# Altium project PCB_Project.PrjPcb
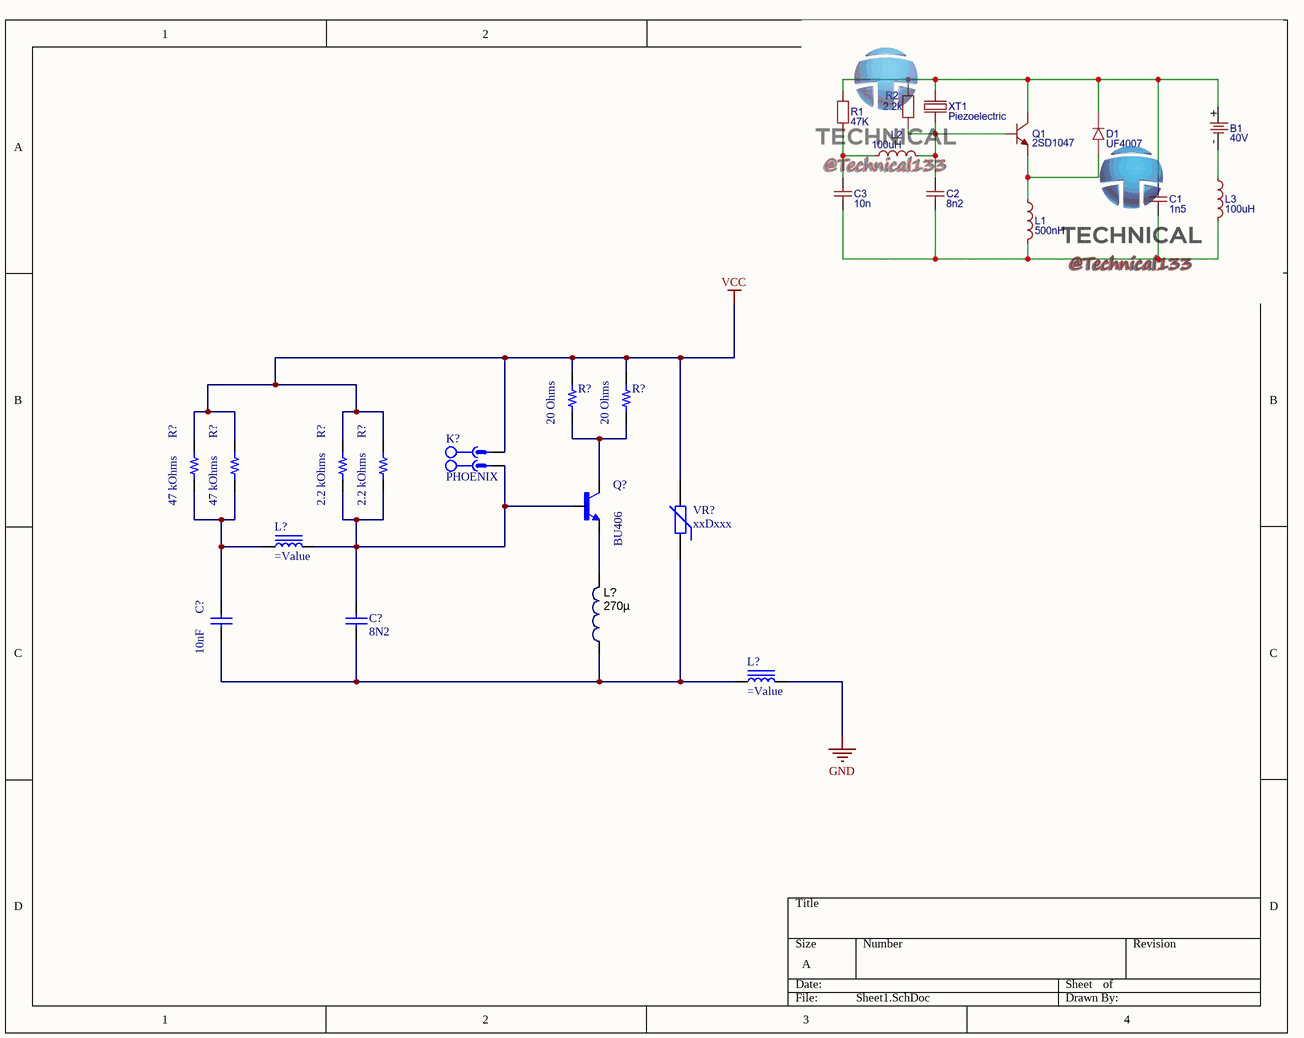
[diagram p0: Sheet1.SchDoc]
3 sheets, 62 parts. Net scope: global (net labels, ports and power ports of the same name join across sheets).
Board file: PCB1.PcbDoc
Sheets:
  Sheet1.SchDoc
  2_POWER.SchDoc
  3_FLOATER.SchDoc

## Sheet Sheet1.SchDoc
size A; SheetNumber: 1; SheetTotal: 2

### Parts
(Parts that share a designator on the sheet are numbered #1, #2 ... from top to bottom, then left to right.)
C?#1  10nF  [Cap-100nF-400V]
C?#2  8N2  [Cap-220n-400V_Poly]
K?  PHOENIX  [KEY]
L?#1  (no value)  [BOURNS SRR1280]
L?#2  270µ  [Inductor 10x12 (200 mils)]
L?#3  (no value)  [BOURNS SRR1280]
Q?#1  BU406
R?#1  20 Ohms  [RES 2512_6432]
R?#2  20 Ohms  [RES 2512_6432]
R?#3  47 kOhms  [RES 1206_3216]
R?#4  47 kOhms  [RES 1206_3216]
R?#5  2.2 kOhms  [RES 1206_3216]
R?#6  2.2 kOhms  [RES 1206_3216]
VR?  xxDxxx  [07D XXX]

### Nets
GND: L?#3.2  [project net floter+l]
VCC: K?.2 R?#1.2 R?#2.2 R?#3.2 R?#4.2 R?#5.2 R?#6.2 VR?.2
NetC?#1_1: C?#1.1 C?#2.1 L?#2.1 L?#3.1 VR?.1
NetC?#1_2: C?#1.2 L?#1.1 R?#3.1 R?#4.1
NetC?#2_2: C?#2.2 K?.1 L?#1.2 Q?#1.1(B) R?#5.1 R?#6.1
NetL?#2_2: L?#2.2 Q?#1.3(E)
NetQ?#1_2: Q?#1.2(C) R?#1.1 R?#2.1

### Library data of the parts
C?#1 C?#2 = CAP CERAMIC TOTAL SIZE: CAP Ceramic Total; Designer: Ali Hafizi
K? = KEY: 2 Pitch: 5.08 mm Color: green Contact surface: Tin Assembly; Manufacturer: PHOENIX CONTACT; Connector type: PCB Terminal Block; designer: ABBAS BASEREH; Max Current: 12 A; Positions: 2; Voltage: 320 V; Category: Connector; ComponentLink1Description: Header, Nominal current: 12 A Rated voltage (III/2): 320 V Number of positions: 2 Pitch: 5.08 mm Color: green Contact surface: Tin Assembly: Soldering  DESIGNER:ABBAS BASEREH; ComponentLink2Description: Reference; Mounting Technology: Through-Hole; Pin Count: 2; Revision 1: 2017-3-1; Status: Unreleased; PART.NO: PHOENIX
L?#1 L?#3 = SRR1280-680M: FIXED IND 68UH 2.4A 120 MOHM SMD; Part Number: SRR1280-680M
L?#2 = POWER INDUCTOR 10x12 (200 mils): Tolerance: ±20%; Type: Ferrite Core; SCDType: source; Package / Case: POWER INDUCTOR 10x12 (200 mils); Supplier 1: Digi-Key; Operating Temperature: -40°C ~ 125°C; Value: 270µ; PUBLISHER: ABBAS BASEREH  2017-3-1
Q?#1 = NPN BJT: Bipolar (BJT) Transistor NPN 40 V 3 A 3MHz 2 W Through Hole TO-220; MF: ON Semiconductor; MP: TIP31G; SnapEDA_Link: https://www.snapeda.com/parts/TIP31G/Onsemi/view-part/?ref=snap; Availability: In Stock; Purchase-URL: https://pricing.snapeda.com/search/part/TIP31G/?ref=eda; Check_prices: https://www.snapeda.com/parts/TIP31G/Onsemi/view-part/?ref=eda; Value: *; Package: TO-220-3 ON Semiconductor; Price: None
R?#1 R?#2 = CRM2512-JW-200ELF: RES SMD 20 OHM 5% 2W 2512; Manufacturer: Bourns Inc.; Temperature Coefficient: ±200ppm/°C; Part Number: CRM2512-JW-200ELF; ComponentLink1Description: Datasheet; ComponentLink1URL: https://www.bourns.com/docs/Product-Datasheets/CRM.pdf; ComponentLink2Description: DigiKey Link; ComponentLink2URL: http://digikey.com/product-detail/en/bourns-inc/CRM2512-JW-200ELF/118-CRM2512-JW-200ELFCT-ND/10673821; Composition: Thick Film; Device Package: 2512 (6432 Metric); Features: Current Sense; Height - Seated (Max): 0.031" (0.80mm); LastUpdated: 9/2/2020 1:26:49 AM; Lifecycle Status: Active; Minimum Order: 1; Number of Terminations: 2; Operating Temperature: -55°C ~ 155°C; Package / Case: 2512 (6432 Metric); Packaging: TapeAndReel; Part Status: Active; Power (Watts): 2W; Price: 0.06; Resistance: 20 Ohms; Series: CRM2512; Size / Dimension: 0.248" L x 0.122" W (6.30mm x 3.10mm); Supplier 1: DigiKey; Supplier Part Number 1: 118-CRM2512-JW-200ELFCT-ND; Supplier Device Package: 2512; Tolerance: ±5%; Value: 20 Ohms
R?#3 R?#4 = ERA-8ARW473V: RES SMD 47K OHM 0.05% 1/4W 1206; Manufacturer: Panasonic Electronic Components; Power (Watts): 0.25W, 1/4W; Temperature Coefficient: ±10ppm/°C; Part Number: ERA-8ARW473V; ComponentLink1Description: Datasheet; ComponentLink1URL: https://industrial.panasonic.com/cdbs/www-data/pdf/RDM0000/AOA0000C307.pdf; ComponentLink2Description: DigiKey Link; ComponentLink2URL: http://digikey.com/product-detail/en/panasonic-electronic-components/ERA-8ARW473V/P47KCTCT-ND/5141480; Composition: Thin Film; Device Package: 1206 (3216 Metric); Features: Automotive AEC-Q200; Height - Seated (Max): 0.028" (0.70mm); LastUpdated: 1/30/2023 8:32:42 PM; Lifecycle Status: Active; Minimum Order: 1; Number of Terminations: 2; Operating Temperature: -55°C ~ 155°C; Package / Case: 1206 (3216 Metric); Packaging: TapeAndReel; PartId: 27491; Part Status: Active; Price: 0.57; Ratings: AEC-Q200; Resistance: 47 kOhms; Series: ERA-8A; Size / Dimension: 0.126" L x 0.063" W (3.20mm x 1.60mm); Supplier 1: DigiKey; Supplier Part Number 1: P47KCTCT-ND; Supplier Device Package: 1206; Tolerance: ±0.05%; Value: 47 kOhms
R?#5 R?#6 = RCS12062K20FKEA: RCS1206 100 2K2 1% ET1 E3; Manufacturer: Vishay Dale; Power (Watts): 0.5W, 1/2W; Temperature Coefficient: ±100ppm/°C; Part Number: RCS12062K20FKEA; ComponentLink1Description: Datasheet; ComponentLink1URL: http://www.vishay.com/docs/20065/rcse3.pdf; ComponentLink2Description: DigiKey Link; ComponentLink2URL: https://www.digikey.com/en/products/detail/vishay-dale/RCS12062K20FKEA/10059678; Composition: Thick Film; Device Package: 1206 (3216 Metric); Features: Automotive AEC-Q200, Pulse Withstanding; Height - Seated (Max): 0.026" (0.65mm); LastUpdated: 1/30/2023 8:31:41 PM; Lifecycle Status: Active; Minimum Order: 1; Number of Terminations: 2; Operating Temperature: -55°C ~ 155°C; Package / Case: 1206 (3216 Metric); Packaging: TapeAndReel; PartId: 40840; Part Status: Active; Price: 0.04; Ratings: AEC-Q200; Resistance: 2.2 kOhms; Series: RCS e3; Size / Dimension: 0.126" L x 0.063" W (3.20mm x 1.60mm); Supplier 1: DigiKey; Supplier Part Number 1: 541-10612-1-ND; Supplier Device Package: 1206; Tolerance: ±1%; Value: 2.2 kOhms
VR? = VARISTOR (VDR): VARISTORS; Manufacturer: china-canada-philipina; Designer: Abbas Basereh; Models: MOV-VDR-COV; Data: 2017-1-5; Link: digikey.com; VALUE: xxDxxx; PUBLISHER: ABBAS BASEREH

## Sheet 2_POWER.SchDoc
size A; SheetNumber: 2; SheetTotal: 3
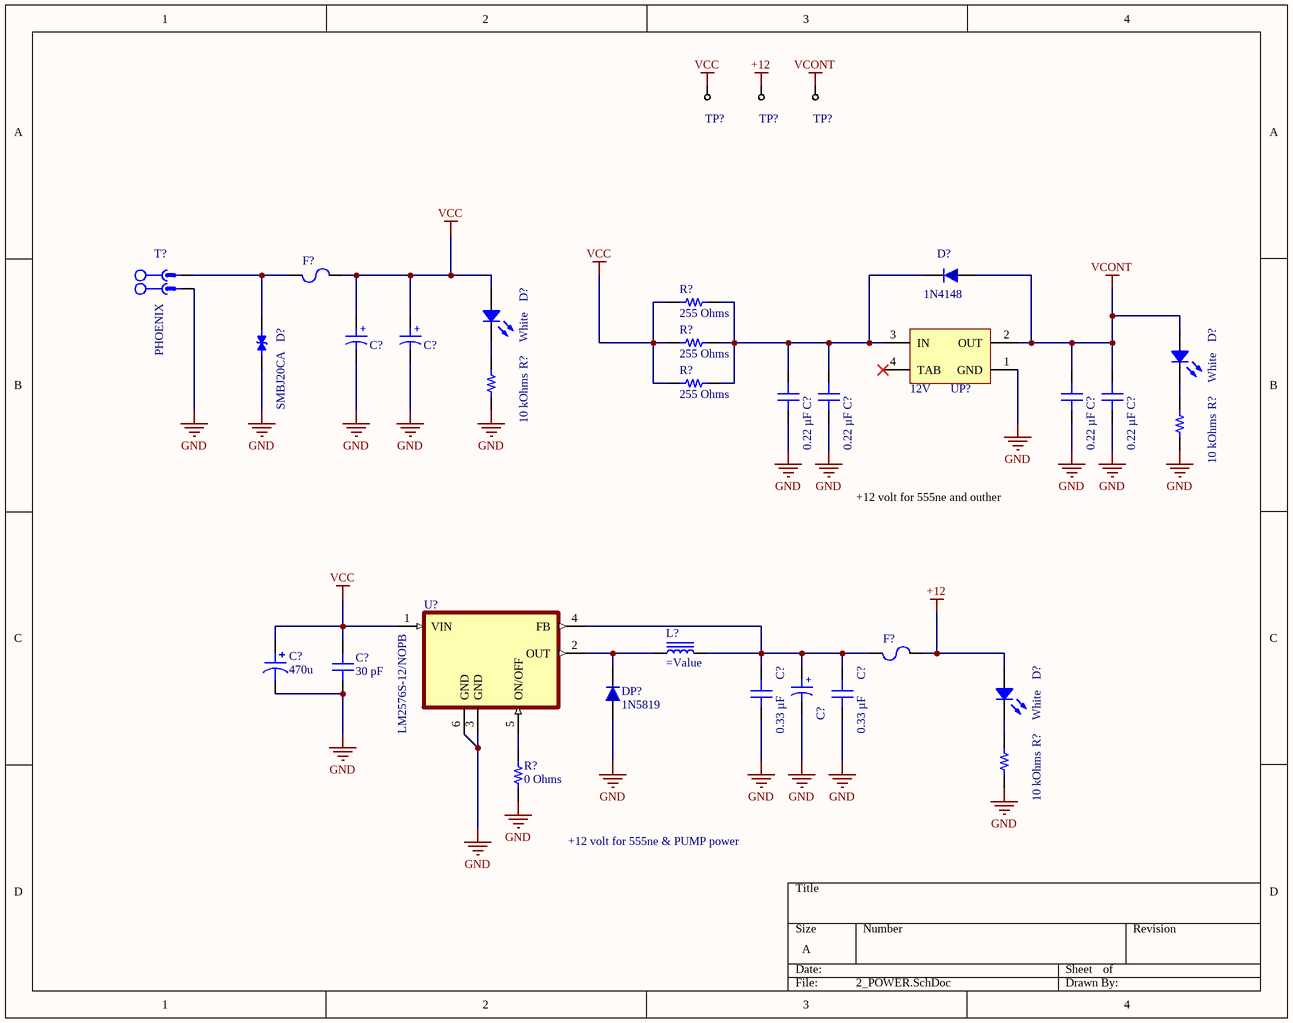
[diagram p1: 2_POWER.SchDoc]

### Parts
(Parts that share a designator on the sheet are numbered #1, #2 ... from top to bottom, then left to right.)
C?#3  Cap 10x21  [Cap electrolitic radial 10x20-5]  (value not drawn)
C?#4  Cap 10x21  [Cap electrolitic radial 10x20-5]  (value not drawn)
C?#5  0.22 µF  [CAP 1206_3216 - 0.8MM]
C?#6  0.22 µF  [CAP 1206_3216 - 0.8MM]
C?#7  0.22 µF  [CAP 1206_3216 - 0.8MM]
C?#8  0.22 µF  [CAP 1206_3216 - 0.8MM]
C?#9  470u  [CAP TH ALUM ELEC D10.00mm S5.00mm H17.50mm]
C?#10  30 pF  [CAP 0603_1608]
C?#11  Cap 10x21  [Cap electrolitic radial 10x20-5]  (value not drawn)
C?#12  0.33 µF  [CAP 0603_1608]
C?#13  0.33 µF  [CAP 0603_1608]
D?#1  1N4148  [Diode 1n4148 SMD]
D?#2  White  [LED 0603_1608]
D?#3  SMBJ20CA  [SMBJ20CA]
D?#4  White  [LED 0603_1608]
D?#5  White  [LED 0603_1608]
DP?#1  1N5819  [1N5819]
F?#1  3413.0214.22  [FUSE 1206_3216 0.6MM]  (value not drawn)
F?#2  3413.0214.22  [FUSE 1206_3216 0.6MM]  (value not drawn)
L?#4  (no value)  [BOURNS SRR1280]
R?#7  255 Ohms  [RES 1206_3216]
R?#8  255 Ohms  [RES 1206_3216]
R?#9  10 kOhms  [RES 0603_1608]
R?#10  255 Ohms  [RES 1206_3216]
R?#11  10 kOhms  [RES 0603_1608]
R?#12  10 kOhms  [RES 0603_1608]
R?#13  0 Ohms  [RES 0603_1608]
T?  PHOENIX  [ptr]
TP?#1  Test Point  [Test Point]  (value not drawn)
TP?#2  Test Point  [Test Point]  (value not drawn)
TP?#3  Test Point  [Test Point]  (value not drawn)
U?  LM2576S-12/NOPB  [LM2576S-12/NOPB]
UP?  12V  [SOT223]

### Nets
+12: D?#5.1 F?#2.2 TP?#2.1(T)
GND: C?#3.2 C?#4.2 C?#5.1 C?#6.1 C?#7.1 C?#8.1 C?#9.2 C?#10.1 C?#11.2 C?#12.1 C?#13.1 D?#3.1 DP?#1.1 R?#9.1 R?#11.1 R?#12.1 R?#13.1 T?.1 U?.3(GND) U?.6(GND) UP?.1(GND)  [project net floter+l]
VCC: C?#3.1 C?#4.1 C?#9.1 C?#10.2 D?#2.1 F?#1.2 R?#7.1 R?#8.1 R?#10.1 TP?#1.1(T) U?.1(VIN)
VCONT: C?#7.2 C?#8.2 D?#1.1 D?#4.1 TP?#3.1(T) UP?.2(OUT)
NetC?#5_2: C?#5.2 C?#6.2 D?#1.2 R?#7.2 R?#8.2 R?#10.2 UP?.3(IN)
NetC?#11_1: C?#11.1 C?#12.2 C?#13.2 F?#2.1 L?#4.2 U?.4(FB)
NetD?#2_2: D?#2.2 R?#9.2
NetD?#3_2: D?#3.2 F?#1.1 T?.2
NetD?#4_2: D?#4.2 R?#11.2
NetD?#5_2: D?#5.2 R?#12.2
NetDP?#1_2: DP?#1.2 L?#4.1 U?.2(OUT)
NetR?#13_2: R?#13.2 U?.5(ON/OFF)

Not connected (* = marked no-connect by the designer): UP? 4(TAB)*

### Notes on the sheet
- +12 volt for 555ne and outher controler
- +12 volt for 555ne & PUMP power
- (in symbol Cap electrolitic radial 10x21) +

### Library data of the parts
C?#3 C?#4 C?#11 = Cap electrolitic radial 10x21: Cap electrolitic radial; Part. No: 100U/50V; Designer: Abbas Basereh; Data: 16-12-2016
C?#5-C?#8 = 885012208089: CAP CER 0.22UF 50V X7R 1206; manufacturer: Würth Elektronik; Tolerance: ±10%; Part Number: 885012208089; Value: 0.22 µF; Applications: General Purpose; Capacitance: 0.22 µF; componentlink1description: Datasheet; componentlink1url: https://katalog.we-online.de/pbs/datasheet/885012208089.pdf; componentlink2description: DigiKey Link; componentlink2url: https://www.digikey.com/en/products/detail/würth-elektronik/885012208089/5453557; Device Package: 1206 (3216 Metric); lastupdated: 1/30/2023 8:13:35 PM; Lifecycle Status: Active; Minimum Order: 1; Mounting Type: Surface Mount, MLCC; Operating Temperature: -55°C ~ 125°C; Package / Case: 1206 (3216 Metric); packaging: TapeAndReel; partid: 19236; Part Status: Active; price: 0.10; series: WCAP-CSGP; Size / Dimension: 0.126" L x 0.063" W (3.20mm x 1.60mm); Supplier 1: DigiKey; Supplier Part Number 1: 732-7702-1-ND; Temperature Coefficient: X7R; Thickness (Max): 0.041" (1.05mm); Voltage - Rated: 50V
C?#9 = UBX1C221MPL1TD: CAP ALUM 220UF 20% 16V RADIAL; manufacturer: Nichicon; Capacitance: 220µF; Lifetime @ Temp.: 1000 Hrs @ 150°C; Polarization: Polar; Ripple Current @ High Frequency: 300mA @ 100kHz; Ripple Current @ Low Frequency: 150mA @ 120Hz; value: 220µF; Part Number: UBX1C221MPL1TD; Applications: Automotive; componentlink1description: Datasheet; componentlink1url: http://nichicon-us.com/english/products/pdfs/e-ubx.pdf; componentlink2description: DigiKey Link; componentlink2url: http://digikey.com/product-detail/en/nichicon/UBX1C221MPL1TD/493-13194-1-ND/4333204; Device Package: Radial, Can; Height - Seated (Max): 0.689" (17.50mm); lastupdated: 9/2/2020 1:31:25 AM; Lead Spacing: 0.197" (5.00mm); Lifecycle Status: Active; Minimum Order: 1; Mounting Type: Through Hole; Operating Temperature: -55°C ~ 150°C; Package / Case: Radial, Can; packaging: TapeAndBox; partid: 12068; Part Status: Active; price: 0.49; series: UBX; Size / Dimension: 0.394" Dia (10.00mm); Supplier 1: DigiKey; Supplier Part Number 1: 493-13194-1-ND; Tolerance: ±20%; Voltage - Rated: 16V
C?#10 = 600S300FT250XT: CAP CER 30PF 250V C0G/NP0 0603; manufacturer: American Technical Ceramics; Temperature Coefficient: C0G, NP0; Tolerance: ±1%; Part Number: 600S300FT250XT; Value: 30 pF; Applications: RF, Microwave, High Frequency, Bypass, Decoupling; Capacitance: 30 pF; componentlink1description: Datasheet; componentlink1url: http://www.atceramics.com/UserFiles/600s.pdf; componentlink2description: DigiKey Link; componentlink2url: https://www.digikey.com/en/products/detail/american-technical-ceramics/600S300FT250XT/3905218; Device Package: 0603 (1608 Metric); Features: High Q, Low Loss, Ultra Low ESR; lastupdated: 1/30/2023 8:08:28 PM; Lifecycle Status: Active; Minimum Order: 1; Mounting Type: Surface Mount, MLCC; Operating Temperature: -55°C ~ 125°C; Package / Case: 0603 (1608 Metric); packaging: TapeAndReel; partid: 2159; Part Status: Active; price: 0.49; series: ATC 600S; Size / Dimension: 0.063" L x 0.032" W (1.60mm x 0.81mm); Supplier 1: DigiKey; Supplier Part Number 1: 1284-1205-1-ND; Thickness (Max): 0.035" (0.89mm); Voltage - Rated: 250V
C?#12 C?#13 = CC0603KRX7R6BB334: CAP CER 0.33UF 10V X7R 0603; manufacturer: Yageo; Tolerance: ±10%; Part Number: CC0603KRX7R6BB334; Value: 0.33 µF; Applications: General Purpose; Capacitance: 0.33 µF; componentlink1description: Datasheet; componentlink1url: https://www.yageo.com/upload/media/product/productsearch/datasheet/mlcc/UPY-GPHC_X7R_6.3V-to-50V_18.pdf; componentlink2description: DigiKey Link; componentlink2url: https://www.digikey.com/en/products/detail/yageo/CC0603KRX7R6BB334/5883747; Device Package: 0603 (1608 Metric); lastupdated: 1/30/2023 8:08:28 PM; Lifecycle Status: Active; Minimum Order: 1; Mounting Type: Surface Mount, MLCC; Operating Temperature: -55°C ~ 125°C; Package / Case: 0603 (1608 Metric); packaging: TapeAndReel; partid: 2209; Part Status: Active; price: 0.01; series: CC; Size / Dimension: 0.063" L x 0.031" W (1.60mm x 0.80mm); Supplier 1: DigiKey; Supplier Part Number 1: 311-3368-1-ND; Temperature Coefficient: X7R; Thickness (Max): 0.035" (0.90mm); Voltage - Rated: 10V
D?#1 = 1N4148 SMD: General Semicoductor
D?#2 D?#4 D?#5 = CL-194S-WS-SD-T: LED WHITE SMD; Manufacturer: Citizen; Configuration: Standard; Current - Test: 5mA; Lens Color: 0.30mm; Lens Size: 1.10mm x 0.80mm; Lens Style: Rectangle with Flat Top; Millicandela Rating: 260mcd; Voltage - Forward (Vf) (Typ): 2.9V; Part Number: CL-194S-WS-SD-T; Color: White; ComponentLink1Description: Datasheet; ComponentLink1URL: http://ce.citizen.co.jp/up_img/product/WBtpQ6f1JXom/CL-194S.pdf; ComponentLink2Description: DigiKey Link; ComponentLink2URL: https://www.digikey.com/en/products/detail/citizen/CL-194S-WS-SD-T/6005902; Device Package: 0603 (1608 Metric); Height (Max): 0.30mm; LastUpdated: 1/30/2023 8:53:40 PM; Lifecycle Status: Active; Minimum Order: 1; Mounting Type: Surface Mount; Package / Case: 0603 (1608 Metric); Packaging: TapeAndReel; PartId: 905; Part Status: Active; Price: 0.07; Series: CL-194S; Size / Dimension: 1.60mm L x 0.80mm W; Supplier 1: DigiKey; Supplier Part Number 1: 1642-1490-1-ND; Value: White
D?#3 = SMBJ20CA: 600W, 23.4V, 5%, Bidirectional, TVS; MF: Taiwan Semiconductor; MP: SMBJ20CA; SnapEDA_Link: https://www.snapeda.com/parts/SMBJ20CA/Taiwan+Semiconductor/view-part/?ref=snap; Value: *; Package: SMB Taiwan Semiconductor; Price: None; Availability: In Stock; Purchase-URL: https://pricing.snapeda.com/search/part/SMBJ20CA/?ref=eda; Check_prices: https://www.snapeda.com/parts/SMBJ20CA/Taiwan+Semiconductor/view-part/?ref=eda
DP?#1 = 1N5819: Schottkey Rectifiers; Designer: Abbas Basereh; Data: 16-12-2016; Link: *; Part. No: *
F?#1 F?#2 = 3413.0214.22: FUSE BOARD MNT 630MA 32VAC 63VDC; Manufacturer: Schurter Inc.; Approval Agency: cURus, VDE; Breaking Capacity @ Rated Voltage: 63A; Fuse Type: Board Mount (Cartridge Style Excluded); Melting I²t: 0.076; Response Time: Fast Blow; Voltage Rating - AC: 32V; Voltage Rating - DC: 63V; Part Number: 3413.0214.22; Approvals: cURus, VDE; ComponentLink1Description: Datasheet; ComponentLink1URL: https://us.schurter.com/pdf/english/typ_USI_1206.pdf; ComponentLink2Description: DigiKey Link; ComponentLink2URL: http://digikey.com/product-detail/en/schurter-inc/3413.0214.22/486-1142-1-ND/1522974; Current Rating (Amps): 630mA; Device Package: 1206 (3216 Metric); LastUpdated: 9/2/2020 1:30:41 AM; Lifecycle Status: Active; Minimum Order: 1; Mounting Type: Surface Mount; Operating Temperature: -55°C ~ 90°C; Package / Case: 1206 (3216 Metric); Packaging: TapeAndReel; Part Status: Active; Price: 0.26; Series: USI 1206; Size / Dimension: 0.126" L x 0.063" W x 0.024" H (3.20mm x 1.60mm x 0.60mm); Supplier 1: DigiKey; Supplier Part Number 1: 486-1142-1-ND
L?#4 = SRR1280-680M: FIXED IND 68UH 2.4A 120 MOHM SMD; Part Number: SRR1280-680M
R?#7 R?#8 R?#10 = RK73H2BTTD2550F: RES 255 OHM 1% 1/4W 1206; Manufacturer: KOA Speer Electronics, Inc.; Power (Watts): 0.25W, 1/4W; Temperature Coefficient: ±100ppm/°C; Part Number: RK73H2BTTD2550F; ComponentLink1Description: Datasheet; ComponentLink1URL: http://www.koaspeer.com/catimages/Products/RK73H/RK73H.pdf; ComponentLink2Description: DigiKey Link; ComponentLink2URL: https://www.digikey.com/en/products/detail/koa-speer-electronics-inc/RK73H2BTTD2550F/10235945; Composition: Thick Film; Device Package: 1206 (3216 Metric); Features: Automotive AEC-Q200, Moisture Resistant; Height - Seated (Max): 0.028" (0.70mm); LastUpdated: 1/30/2023 8:32:45 PM; Lifecycle Status: Active; Minimum Order: 1; Number of Terminations: 2; Operating Temperature: -55°C ~ 155°C; Package / Case: 1206 (3216 Metric); Packaging: TapeAndReel; PartId: 27211; Part Status: Active; Price: 0.01; Ratings: AEC-Q200; Resistance: 255 Ohms; Series: RK73H; Size / Dimension: 0.126" L x 0.063" W (3.20mm x 1.60mm); Supplier 1: DigiKey; Supplier Part Number 1: 2019-RK73H2BTTD2550FCT-ND; Supplier Device Package: 1206; Tolerance: ±1%; Value: 255 Ohms
R?#9 R?#11 R?#12 = CPF0603B10KE: RES SMD 10K OHM 0.1% 1/16W 0603; Manufacturer: TE Connectivity Passive Product; Power (Watts): 0.063W, 1/16W; Temperature Coefficient: ±25ppm/°C; Part Number: CPF0603B10KE; Value: 10 kOhms; ComponentLink1Description: Datasheet; ComponentLink1URL: https://www.te.com/commerce/DocumentDelivery/DDEController?Action=srchrtrv&DocNm=1773200&DocType=DS&DocLang=English; ComponentLink2Description: DigiKey Link; ComponentLink2URL: https://www.digikey.com/en/products/detail/te-connectivity-passive-product/CPF0603B10KE/2389826; Composition: Thin Film; Device Package: 0603 (1608 Metric); Height - Seated (Max): 0.022" (0.55mm); LastUpdated: 1/24/2023 9:54:36 PM; Lifecycle Status: Active; Minimum Order: 1; Number of Terminations: 2; Operating Temperature: -55°C ~ 155°C; Package / Case: 0603 (1608 Metric); Packaging: TapeAndReel; PartId: 4872; Part Status: Active; Price: 0.09; Resistance: 10 kOhms; Series: CPF, Neohm; Size / Dimension: 0.061" L x 0.031" W (1.55mm x 0.80mm); Supplier 1: DigiKey; Supplier Part Number 1: A119886CT-ND; Supplier Device Package: 0603; Tolerance: ±0.1%
R?#13 = PA0603-R-070RL: RES 0 OHM JUMPER 1/10W 0603; Manufacturer: Yageo; Power (Watts): 0.1W, 1/10W; Temperature Coefficient: ±150ppm/°C; Part Number: PA0603-R-070RL; Value: 0 Ohms; ComponentLink1Description: Datasheet; ComponentLink1URL: http://www.yageo.com/NewPortal/_en/search/productDocs.jsp?YageoPartNumber=PA0603-R-070RL; ComponentLink2Description: DigiKey Link; ComponentLink2URL: https://www.digikey.com/en/products/detail/yageo/PA0603-R-070RL/8255972; Composition: Metal Element; Device Package: 0603 (1608 Metric); Features: Automotive AEC-Q200, Current Sense; Height - Seated (Max): 0.024" (0.60mm); LastUpdated: 1/24/2023 9:54:36 PM; Lifecycle Status: Active; Minimum Order: 1; Number of Terminations: 2; Operating Temperature: -55°C ~ 155°C; Package / Case: 0603 (1608 Metric); Packaging: TapeAndReel; PartId: 4862; Part Status: Active; Price: 0.08; Resistance: 0 Ohms; Series: PA; Size / Dimension: 0.063" L x 0.031" W (1.60mm x 0.80mm); Supplier 1: DigiKey; Supplier Part Number 1: YAG5757CT-ND; Supplier Device Package: 0603; Tolerance: Jumper
T? = ptr: 2 Pitch: 5.08 mm Color: green Contact surface: Tin Assembly; Manufacturer: PHOENIX CONTACT; Connector type: PCB Terminal Block; designer: ABBAS BASEREH; Max Current: 12 A; Positions: 2; Voltage: 320 V; Category: Connector; ComponentLink1Description: Header, Nominal current: 12 A Rated voltage (III/2): 320 V Number of positions: 2 Pitch: 5.08 mm Color: green Contact surface: Tin Assembly: Soldering  DESIGNER:ABBAS BASEREH; ComponentLink2Description: Reference; Mounting Technology: Through-Hole; Pin Count: 2; Revision 1: 2017-3-1; Status: Unreleased; PART.NO: PHOENIX
UP? = AMS1117-x.x: x.x Volt, 800mA Low-Dropout Linear Regulator, 4-pin SOT-223; Designer: Ali Hafizi; Data: 16-12-2016
U? = LM2576S-12/NOPB: Package: None; Price: None; Availability: Unavailable; MP: LM2576S-12; Value: *

## Sheet 3_FLOATER.SchDoc
size A; SheetNumber: 3; SheetTotal: 3
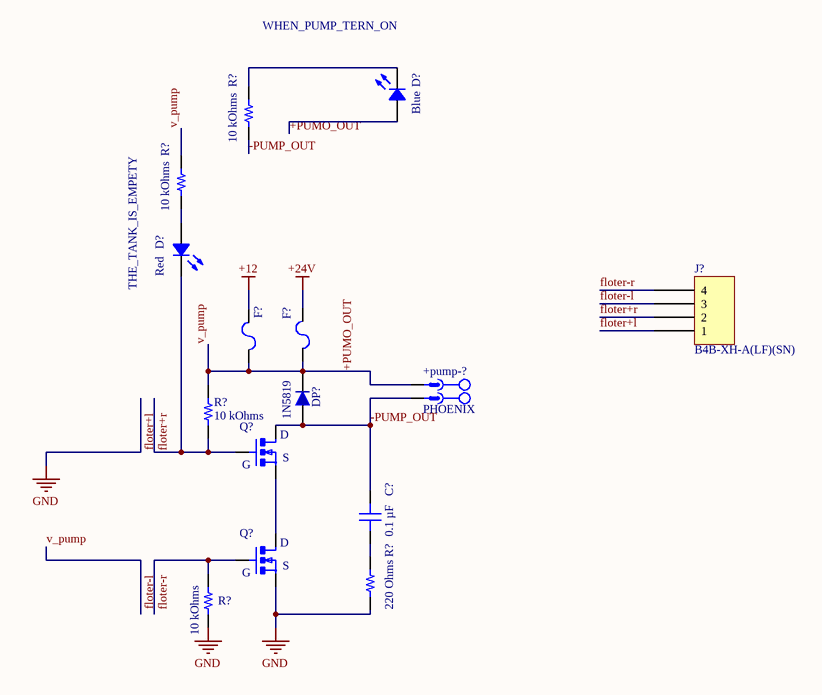
[diagram p2: 3_FLOATER.SchDoc]

### Parts
(Parts that share a designator on the sheet are numbered #1, #2 ... from top to bottom, then left to right.)
+pump-?  PHOENIX  [691321300002]
C?#14  0.1 µF  [CAP 0603_1608]
D?#6  Blue  [LED 0603_1608 BLUE]
D?#7  Red  [LED 0603_1608 RED]
DP?#2  1N5819  [1N5819]
F?#3  3413.0328.22  [FUSE 1206_3216 0.6MM]  (value not drawn)
F?#4  3413.0328.22  [FUSE 1206_3216 0.6MM]  (value not drawn)
J?  B4B-XH-A(LF)(SN)  [JST XH B4B-XH-A]
Q?#2  MTD20N03HDL-SMD  [MTD20N03HDL-SMD]  (value not drawn)
Q?#3  MTD20N03HDL-SMD  [MTD20N03HDL-SMD]  (value not drawn)
R?#14  10 kOhms  [RES 0603_1608]
R?#15  10 kOhms  [RES 0603_1608]
R?#16  10 kOhms  [RES 0603_1608]
R?#17  220 Ohms  [RES 0603_1608]
R?#18  10 kOhms  [RES 0603_1608]

### Nets
+12: F?#3.2
+24V: F?#4.2
floter+l: J?.1 Q?#3.3(S) R?#17.1 R?#18.1  [also labelled GND]
+PUMO_OUT: +pump-?.1 D?#6.1 DP?#2.2 F?#3.1 F?#4.1 J?.3 R?#15.2 R?#16.2  [also labelled floter-l, v_pump]
-PUMP_OUT: +pump-?.2 C?#14.2 DP?#2.1 Q?#2.2(D) R?#14.1
floter+r: D?#7.2 J?.2 Q?#2.1(G) R?#16.1
floter-r: J?.4 Q?#3.1(G) R?#18.2
NetC?#14_1: C?#14.1 R?#17.2
NetD?#6_2: D?#6.2 R?#14.2
NetD?#7_1: D?#7.1 R?#15.1
NetQ?#2_3: Q?#2.3(S) Q?#3.2(D)

### Notes on the sheet
- WHEN_PUMP_TERN_ON
- THE_TANK_IS_EMPETY

### Library data of the parts
+pump-? = KEY_1: 2 Pitch: 5.08 mm Color: green Contact surface: Tin Assembly_saf; Manufacturer: PHOENIX CONTACT; Connector type: PCB Terminal Block; designer: ABBAS BASEREH; Max Current: 12 A; Positions: 2; Voltage: 320 V; Category: Connector; ComponentLink1Description: Header, Nominal current: 12 A Rated voltage (III/2): 320 V Number of positions: 2 Pitch: 5.08 mm Color: green Contact surface: Tin Assembly: Soldering  DESIGNER:ABBAS BASEREH; ComponentLink2Description: Reference; Mounting Technology: Through-Hole; Pin Count: 2; Revision 1: 2017-3-1; Status: Unreleased; PART.NO: PHOENIX
C?#14 = C0603C104K5RAC7411: CAP CER 0.1UF 50V X7R 0603; Part Number: C0603C104K5RAC7411; Value: 0.1 µF
D?#6 = SML-LX0603USBW-TR: LED 470NM USBLU WHT DF 0603 T/R; Manufacturer: Lumex Opto/Components Inc.; Configuration: Standard; Current - Test: 20mA; Lens Color: White; Lens Size: 1.00mm x 0.80mm; Lens Style: Rectangle with Flat Top; Lens Transparency: Diffused; Millicandela Rating: 112.5mcd; Viewing Angle: 140°; Voltage - Forward (Vf) (Typ): 3.3V; Part Number: SML-LX0603USBW-TR; Color: Blue; ComponentLink1Description: Datasheet; ComponentLink1URL: https://www.lumex.com/content/files/ProductAttachment/SML-LX0603USBW-TR.pdf; ComponentLink2Description: DigiKey Link; ComponentLink2URL: https://www.digikey.com/en/products/detail/lumex-opto-components-inc/SML-LX0603USBW-TR/515780; Device Package: 0603 (1608 Metric); Height (Max): 0.85mm; LastUpdated: 1/30/2023 8:49:34 PM; Lifecycle Status: Active; Minimum Order: 1; Mounting Type: Surface Mount; Package / Case: 0603 (1608 Metric); Packaging: TapeAndReel; PartId: 804; Part Status: Active; Price: 0.76; Series: -; Size / Dimension: 1.60mm L x 0.80mm W; Supplier 1: DigiKey; Supplier Part Number 1: 67-2305-1-ND; Supplier Device Package: 0603; Value: Blue; Wavelength - Peak: 470nm
D?#7 = CSL0901UT: HIGH BRIGHTNESS LENS TYPE LED; C; Manufacturer: Rohm Semiconductor; Configuration: 0603; Current - Test: 20mA; Lens Color: Colorless; Lens Size: 1.14mm Dia; Lens Style: Round with Domed Top; Lens Transparency: Clear; Millicandela Rating: 280mcd; Voltage - Forward (Vf) (Typ): 2.1V; Wavelength - Dominant: 620nm; Part Number: CSL0901UT; Color: Red; ComponentLink1Description: Datasheet; ComponentLink1URL: https://www.rohm.com/datasheet/CSL0901UT/csl0901-e; ComponentLink2Description: DigiKey Link; ComponentLink2URL: https://www.digikey.com/en/products/detail/rohm-semiconductor/CSL0901UT/10222160; Device Package: 0603 (1608 Metric); Height (Max): 1.34mm; LastUpdated: 1/30/2023 8:50:27 PM; Lifecycle Status: Active; Minimum Order: 1; Mounting Type: Surface Mount; Package / Case: 0603 (1608 Metric); Packaging: TapeAndReel; PartId: 428; Part Status: Active; Price: 0.12; Series: CSL090x; Size / Dimension: 1.60mm L x 0.80mm W; Supplier 1: DigiKey; Supplier Part Number 1: CSL0901UTCT-ND; Supplier Device Package: 0603; Value: Red
DP?#2 = 1N5819: as DP?#1 on sheet 2_POWER; Data: 16-12-2016; Link: *; Part. No: *
F?#3 F?#4 = 3413.0328.22: FUSE BOARD MOUNT 10A 32VAC 63VDC; Manufacturer: Schurter Inc.; Approval Agency: cURus; Breaking Capacity @ Rated Voltage: 100A; Fuse Type: Board Mount (Cartridge Style Excluded); Melting I²t: 21; Response Time: Slow Blow; Voltage Rating - AC: 32V; Voltage Rating - DC: 63V; Part Number: 3413.0328.22; Approvals: cURus; ComponentLink1Description: Datasheet; ComponentLink1URL: https://us.schurter.com/pdf/english/typ_UST_1206.pdf; ComponentLink2Description: DigiKey Link; ComponentLink2URL: http://digikey.com/product-detail/en/schurter-inc/3413.0328.22/486-1686-1-ND/2870095; Current Rating (Amps): 10A; Device Package: 1206 (3216 Metric); LastUpdated: 9/2/2020 1:30:41 AM; Lifecycle Status: Active; Minimum Order: 1; Mounting Type: Surface Mount; Operating Temperature: -55°C ~ 90°C; Package / Case: 1206 (3216 Metric); Packaging: TapeAndReel; Part Status: Active; Price: 0.21; Series: UST 1206; Size / Dimension: 0.126" L x 0.063" W x 0.024" H (3.20mm x 1.60mm x 0.60mm); Supplier 1: DigiKey; Supplier Part Number 1: 486-1686-1-ND
J? = B4B-XH-A(LF)(SN): CONN HEADER VERT 4POS 2.5MM; Manufacturer: JST Sales America Inc.; Contact Length - Post: 0.134" (3.40mm); Current Rating (Amps): 3A; Material Flammability Rating: UL94 V-0; Number of Positions: 4; Number of Positions Loaded: All; Pitch - Mating: 0.098" (2.50mm); Shrouding: Shrouded - 4 Wall; Style: Board to Cable/Wire; Voltage Rating: 250V; Part Number: B4B-XH-A(LF)(SN); ComponentLink1Description: Datasheet; ComponentLink1URL: http://www.jst-mfg.com/product/pdf/eng/eXH.pdf; ComponentLink2Description: DigiKey Link; ComponentLink2URL: http://digikey.com/product-detail/en/jst-sales-america-inc/B4B-XH-A-LF-SN/455-2249-ND/1651047; Connector Type: Header; Contact Finish - Mating: Tin; Contact Finish - Post: Tin; Contact Material: Brass; Contact Shape: Square; Contact Type: Male Pin; Fastening Type: Detent Lock; Insulation Color: Natural; Insulation Height: 0.276" (7.00mm); Insulation Material: Polyamide (PA66), Nylon 6/6; LastUpdated: 1/12/2020 11:46:34 PM; Lifecycle Status: Active; Minimum Order: 1; Mounting Type: Through Hole; Number of Rows: 1; Operating Temperature: -25°C ~ 85°C; Packaging: Bulk; PartId: 69; Part Status: Active; Price: 0.21; Series: XH; Supplier 1: DigiKey; Supplier Part Number 1: 455-2249-ND; Termination: Press-Fit, Solder
Q?#2 Q?#3 = MTD20N03HDL-SMD: N-Channel 55V 29A (Tc) 3.8W (Ta), 68W (Tc) Surface Mount D2PAK; MP: IRFZ34N; MF: Infineon / IR; Price: None; Value: *; Package: TO-220-3 Infineon / IR; SnapEDA_Link: https://www.snapeda.com/parts/IRFZ34N/Infineon/view-part/4702946/?ref=snap; Check_prices: https://www.snapeda.com/parts/IRFZ34N/Infineon/view-part/4702946/?ref=eda; Availability: Bad
R?#14-R?#16 R?#18 = RNCS0603BKE10K0: RES 10K OHM 0.1% 1/16W 0603; Manufacturer: Stackpole Electronics Inc; Power (Watts): 0.063W, 1/16W; Temperature Coefficient: ±25ppm/°C; Part Number: RNCS0603BKE10K0; Value: 10 kOhms; ComponentLink1Description: Datasheet; ComponentLink1URL: https://www.seielect.com/catalog/sei-rncs_rnch.pdf; ComponentLink2Description: DigiKey Link; ComponentLink2URL: https://www.digikey.com/en/products/detail/stackpole-electronics-inc/RNCS0603BKE10K0/1708836; Composition: Thin Film; Device Package: 0603 (1608 Metric); Features: Anti-Corrosive, Automotive AEC-Q200, Moisture Resistant; Height - Seated (Max): 0.022" (0.55mm); LastUpdated: 9/19/2022 1:22:34 PM; Lifecycle Status: Active; Minimum Order: 1; Number of Terminations: 2; Operating Temperature: -55°C ~ 155°C; Package / Case: 0603 (1608 Metric); Packaging: TapeAndReel; PartId: 4838; Part Status: Active; Price: 0.07; Ratings: AEC-Q200; Resistance: 10 kOhms; Series: RNCS; Size / Dimension: 0.061" L x 0.031" W (1.55mm x 0.80mm); Supplier 1: DigiKey; Supplier Part Number 1: RNCS0603BKE10K0CT-ND; Supplier Device Package: 0603; Tolerance: ±0.1%
R?#17 = CRCW0603220RFKEA: RES SMD 220 OHM 1% 1/10W 0603; Part Number: CRCW0603220RFKEA; Value: 220 Ohms

## Nets that join several sheets
+12: 2_POWER (D?#5.1 F?#2.2 TP?#2.1), 3_FLOATER (F?#3.2)
floter+l: Sheet1 (L?#3.2), 2_POWER (21 pins), 3_FLOATER (J?.1 Q?#3.3 R?#17.1 R?#18.1)
VCC: Sheet1 (8 pins), 2_POWER (11 pins)